# Altium schematic sheet STM32.SchDoc: TMC2130
size A; DrawnBy: Luka & Emile
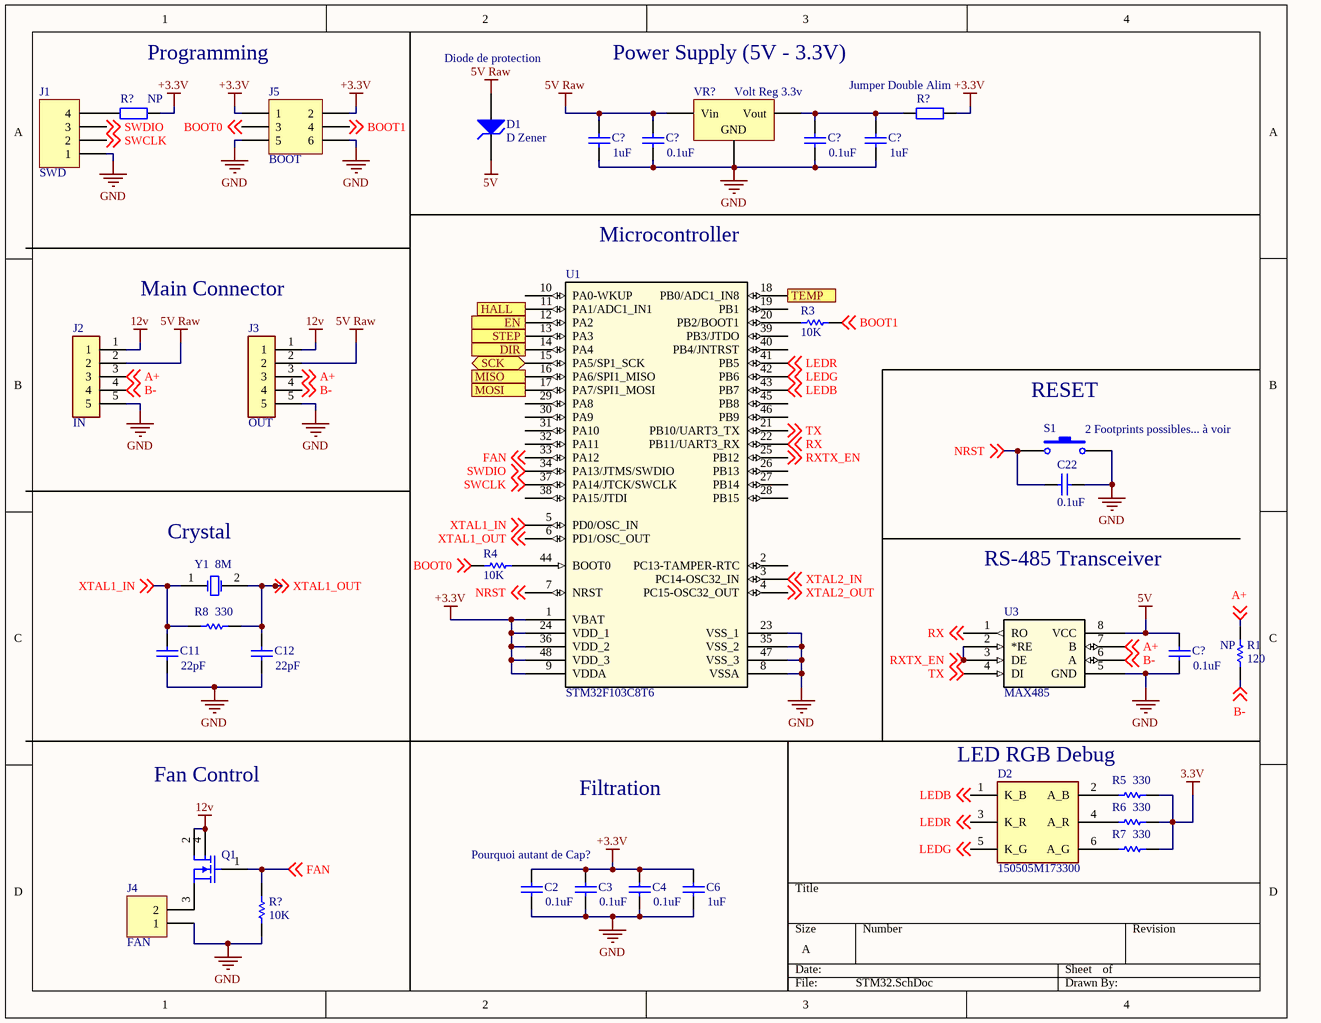
[diagram p0: STM32.SchDoc]

## Parts
(Parts that share a designator on the sheet are numbered #1, #2 ... from top to bottom, then left to right.)
C2  value 0.1uF  [RAD-0.3]
C3  value 0.1uF  [RAD-0.3]
C4  value 0.1uF  [RAD-0.3]
C6  value 1uF  [RAD-0.3]
C11  value 22pF  [RAD-0.3]
C12  value 22pF  [RAD-0.3]
C22  value 0.1uF  [RAD-0.3]
C?#1  value 1uF  [RAD-0.3]
C?#2  value 0.1uF  [RAD-0.3]
C?#3  value 0.1uF  [RAD-0.3]
C?#4  value 1uF  [RAD-0.3]
C?#5  value 0.1uF  [RAD-0.3]
D1  D Zener  [DIODE-0.7]
D2  150505M173300  [150505M173300]
J1  SWD  [HDR1X4]
J2  IN  [S5BXHA1LFSN]
J3  OUT  [S5BXHA1LFSN]
J4  FAN  [HDR1X2]
J5  BOOT  [HDR2X3]
Q1  MOSFET N-CH  [SOT223_M]  (value not drawn)
R1  NP  value 120  [AXIAL-0.3]
R3  value 10K  [AXIAL-0.3]
R4  value 10K  [AXIAL-0.3]
R5  value 330  [AXIAL-0.3]
R6  value 330  [AXIAL-0.3]
R7  value 330  [AXIAL-0.3]
R8  value 330  [AXIAL-0.3]
R?#1  NP  [AXIAL-0.4]
R?#2  Res2  [AXIAL-0.4]  (value not drawn)
R?#3  value 10K  [AXIAL-0.3]
S1  SW-PB  [SPST-2]  (value not drawn)
U1  STM32F103C8T6  [LQFP-48]
U3  MAX485  [21-0043D_8]
VR?  Volt Reg 3.3v  [D2PAK_N]
Y1  8M  [ATS080B-E]

## Ports
DIR (out), EN (out), HALL (in), MISO (in), MOSI (out), SCK (bidir), STEP (out), TEMP (in)

## Nets
3.3V: R5.1 R6.1 R7.1
5V: C?#5.1 D1.2(K) U3.8(VCC)
5V Raw: C?#1.1 C?#2.1 D1.1(A) J2.2 J3.2 VR?.1(Vin)
12v: J2.1 J3.1 Q1.2(D) Q1.4(D)
+3.3V: C2.1 C3.1 C4.1 C6.1 J5.1 J5.2 R?#1.2 R?#2.2 U1.1(VBAT) U1.9(VDDA) U1.24(VDD_1) U1.36(VDD_2) U1.48(VDD_3)
GND: C2.2 C3.2 C4.2 C6.2 C11.2 C12.2 C22.2 C?#1.2 C?#2.2 C?#3.2 C?#4.2 C?#5.2 J1.1 J2.5 J3.5 J4.1 J5.5 J5.6 R?#3.1 S1.2 U1.8(VSSA) U1.23(VSS_1) U1.35(VSS_2) U1.47(VSS_3) U3.5(GND) VR?.2(GND)
A+: J2.3 J3.3 R1.2 U3.7(B) ; off-sheet A+
B-: J2.4 J3.4 R1.1 U3.6(A) ; off-sheet B-
BOOT0: J5.3 R4.2 ; off-sheet BOOT0
BOOT1: J5.4 R3.1 ; off-sheet BOOT1
DIR: U1.14(PA4) ; port DIR
EN: U1.12(PA2) ; port EN
FAN: Q1.1(G) R?#3.2 U1.33(PA12) ; off-sheet FAN
HALL: U1.11(PA1/ADC1_IN1) ; port HALL
LEDB: D2.1(K_B) U1.43(PB7) ; off-sheet LEDB
LEDG: D2.5(K_G) U1.42(PB6) ; off-sheet LEDG
LEDR: D2.3(K_R) U1.41(PB5) ; off-sheet LEDR
MISO: U1.16(PA6/SPI1_MISO) ; port MISO
MOSI: U1.17(PA7/SPI1_MOSI) ; port MOSI
NRST: C22.1 S1.1 U1.7(NRST) ; off-sheet NRST
RX: U1.22(PB11/UART3_RX) U3.1(RO) ; off-sheet RX
RXTX_EN: U1.25(PB12) U3.2(*RE) U3.3(DE) ; off-sheet RXTX_EN
SCK: U1.15(PA5/SP1_SCK) ; port SCK
STEP: U1.13(PA3) ; port STEP
SWCLK: J1.2 U1.37(PA14/JTCK/SWCLK) ; off-sheet SWCLK
SWDIO: J1.3 U1.34(PA13/JTMS/SWDIO) ; off-sheet SWDIO
TEMP: U1.18(PB0/ADC1_IN8) ; port TEMP
TX: U1.21(PB10/UART3_TX) U3.4(DI) ; off-sheet TX
XTAL1_IN: C11.1 R8.2 U1.5(PD0/OSC_IN) Y1.1(OSC1) ; off-sheet XTAL1_IN
XTAL1_OUT: C12.1 R8.1 U1.6(PD1/OSC_OUT) Y1.2(OSC2) ; off-sheet XTAL1_OUT
XTAL2_IN: U1.3(PC14-OSC32_IN) ; off-sheet XTAL2_IN
XTAL2_OUT: U1.4(PC15-OSC32_OUT) ; off-sheet XTAL2_OUT
NetC?#3_1: C?#3.1 C?#4.1 R?#2.1 VR?.3(Vout)
NetD2_2: D2.2(A_B) R5.2
NetD2_4: D2.4(A_R) R6.2
NetD2_6: D2.6(A_G) R7.2
NetJ1_4: J1.4 R?#1.1
NetJ4_2: J4.2 Q1.3(S)
NetR3_2: R3.2 U1.20(PB2/BOOT1)
NetR4_1: R4.1 U1.44(BOOT0)

Not connected (* = marked no-connect by the designer): U1 2(PC13-TAMPER-RTC) 10(PA0-WKUP) 19(PB1) 26(PB13) 27(PB14) 28(PB15) 29(PA8) 30(PA9) 31(PA10) 32(PA11) 38(PA15/JTDI) 39(PB3/JTDO) 40(PB4/JNTRST) 45(PB8) 46(PB9)

## Notes on the sheet
- Programming
- Diode de protection
- Power Supply (5V - 3.3V)
- (near R?#2) Jumper Double Alim
- Main Connector
- (near U1) Microcontroller
- (near S1) RESET
- (near S1) 2 Footprints possibles... à voir
- (near Y1) Crystal
- RS-485 Transceiver
- LED RGB Debug
- Fan Control
- Filtration
- Pourquoi autant de Cap?

## Library data of the parts
C2-C4 C6 C11 C12 C22 C?#1-C?#5 = Cap: Capacitor; Published: 8-Jun-2000; LatestRevisionDate: 17-Jul-2002; LatestRevisionNote: Re-released for DXP Platform.; PackageReference: RAD-0.3; Publisher: Altium Limited; PackageDescription: Radial Cap, Thru-Hole; 2 Leads; 0.3 in Pin Spacing
D1 = D Zener: Zener Diode; Published: 8-Jun-2000; LatestRevisionDate: 17-Jul-2002; LatestRevisionNote: Re-released for DXP Platform.; PackageReference: DIODE-0.7; Publisher: Altium Limited; PackageDescription: Diode, Thru-Hole; 2 Leads; 0.7 in Pin Spacing
D2 = 150505M173300: LED; Manufacturer_Name: Wurth Elektronik; Datasheet Link: https://katalog.we-online.de/led/datasheet/150505M173300.pdf; Height: 1.8mm; Manufacturer_Part_Number: 150505M173300; Mouser Part Number: 710-150505M173300; Mouser Price/Stock: https://www.mouser.com/Search/Refine.aspx?Keyword=710-150505M173300; RS Part Number: 1766248P; RS Price/Stock: http://uk.rs-online.com/web/p/products/1766248P
J1 = Header 4: Header, 4-Pin; LatestRevisionDate: 17-Jul-2002; LatestRevisionNote: Re-released for DXP Platform.; Publisher: Altium Limited
J2 J3 = JST 5POS: Connector; Manufacturer_Name: JST (JAPAN SOLDERLESS TERMINALS); Manufacturer_Part_Number: S5B-XH-A-1(LF)(SN); Datasheet Link: http://www.jst-mfg.com/product/pdf/eng/eXH.pdf; Height: 6.1mm
J4 = Header 2: Header, 2-Pin; LatestRevisionDate: 17-Jul-2002; LatestRevisionNote: Re-released for DXP Platform.; Publisher: Altium Limited
J5 = Header 3X2: Header, 3-Pin, Dual row; LatestRevisionDate: 17-Jul-2002; LatestRevisionNote: Re-released for DXP Platform.; Publisher: Altium Limited
Q1 = MOSFET N-CH: 55V 7A SOT223; ComponentLink1Description: Datasheet; ComponentLink1URL: https://assets.nexperia.com/documents/data-sheet/BUK9880-55A.pdf; ComponentLink2Description: Digikey; ComponentLink2URL: https://www.digikey.ca/product-detail/en/BUK9880-55A%2fCUX/1727-2230-1-ND/5361200/?itemSeq=318542302
R1 R3-R8 R?#3 = Res1: Resistor; Published: 8-Jun-2000; LatestRevisionDate: 17-Jul-2002; LatestRevisionNote: Re-released for DXP Platform.; PackageReference: AXIAL-0.3; Publisher: Altium Limited; PackageDescription: Axial Device, Thru-Hole; 2 Leads; 0.3 in Pin Spacing
R?#1 R?#2 = Res2: Resistor; Published: 8-Jun-2000; LatestRevisionDate: 17-Jul-2002; LatestRevisionNote: Re-released for DXP Platform.; PackageReference: AXIAL-0.4; Publisher: Altium Limited; PackageDescription: Axial Device, Thru-Hole; 2 Leads; 0.4 in Pin Spacing
S1 = SW-PB: Switch; Published: 24-Mar-1999; LatestRevisionDate: 17-Jul-2002; LatestRevisionNote: Re-released for DXP Platform.; PackageReference: SPST-2; Publisher: Altium Limited; PackageDescription: Switch; 2 Leads
U1 = STM32F103C8T6: Integrated Circuit STM32; Vendor: STMicroelectronics; Built_By: EMA_UL_Team; Manufacturer_Part_Number: STM32F103C8T6; Copyright: Copyright (C) 2018 Accelerated Designs. All rights reserved; RefDes: RefDes; Type: DEV; Value: Value
U3 = MAX485CPA+: RS485 Communication; Vendor: Maxim Integrated Products; Built_By: EMA_UL_Team; Manufacturer_Part_Number: MAX485CPA+; Copyright: Copyright (C) 2018 Accelerated Designs. All rights reserved; RefDes: RefDes; Type: DEV; Value: Value
VR? = Volt Reg: Voltage Regulator; Published: 24-Mar-1999; LatestRevisionDate: 29-May-2009; LatestRevisionNote: IPC-7351 Footprint Added.; PackageReference: D2PAK; Publisher: Altium Limited; PackageDescription: 3-Pin Transistor Outline Package 2.54 mm Pitch, 15.1 mm Lead Span
Y1 = XTAL: Crystal Oscillator; Published: 8-Jun-2000; LatestRevisionDate: 17-Jul-2002; LatestRevisionNote: Re-released for DXP Platform.; PackageReference: R38; Publisher: Altium Limited; PackageDescription: Crystal, Thru-Hole; 2 Leads; Body 3.1 x 8.2 mm (Dia.xH)